# EAGLE design Silent Stepper Driver (EAGLE 7.5.0)
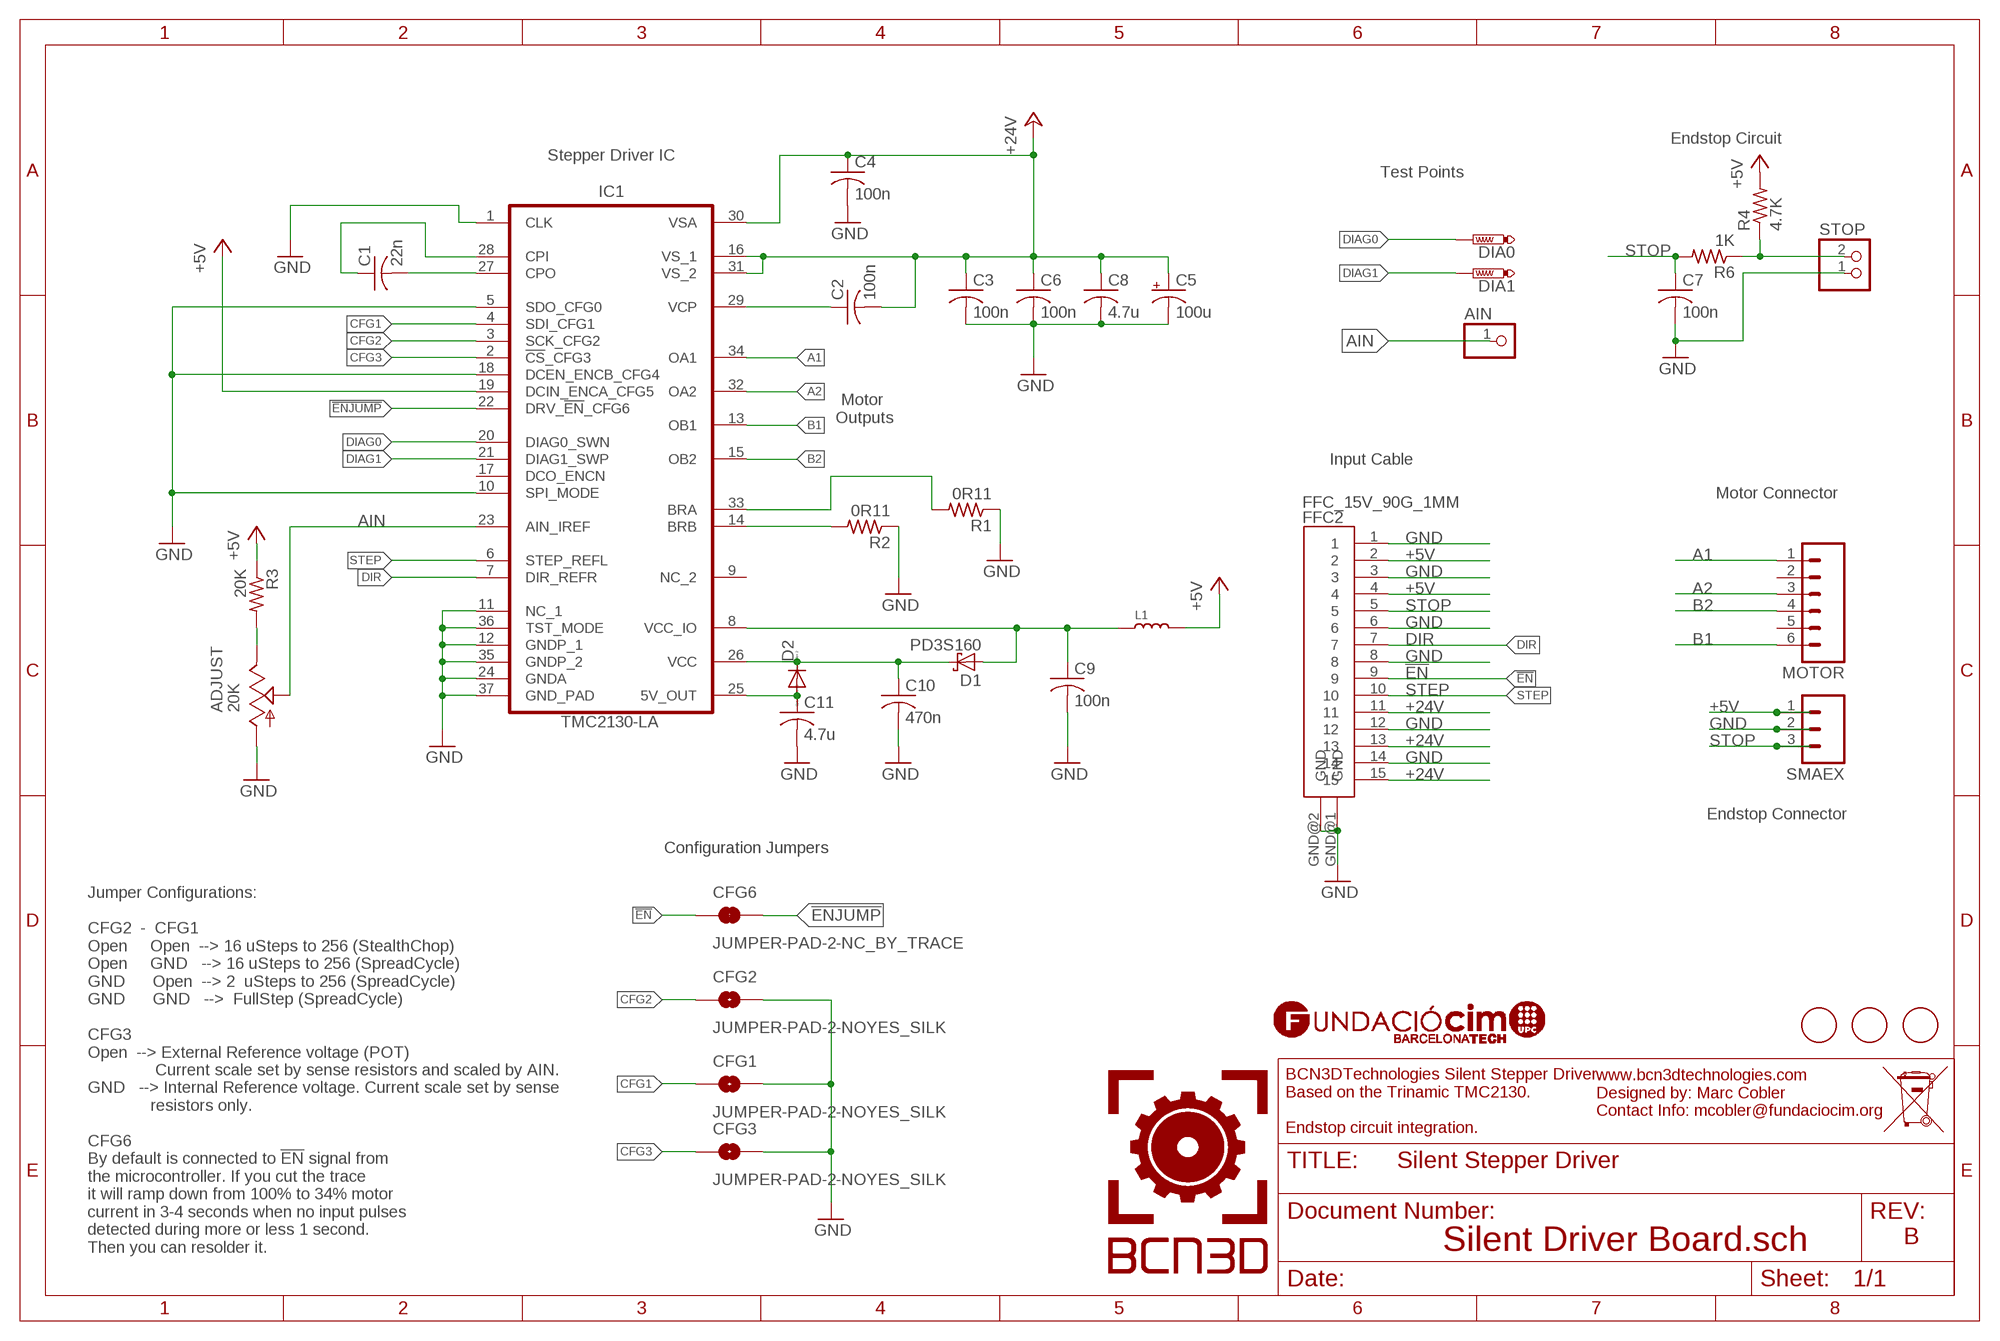
[diagram p0: schematic, sheet 1]

## Parts
ADJUST  20K  TRIM_US-3223G  [3223G]
AIN  PINHD-1X1  [1X01]
C1  22n  C-USC0603K  [C0603K]
C2  100n  C-USC0603K  [C0603K]
C3  100n  C-USC0603K  [C0603K]
C4  100n  C-USC0603K  [C0603K]
C5  100u  CPOL-USUD-6,3X7,7  [UD-6,3X7,7_NICHICON]
C6  100n  C-USC0603K  [C0603K]
C7  100n  C-USC0603K  [C0603K]
C8  4.7u  C-USC1210  [C1210]
C9  100n  C-USC0603K  [C0603K]
C10  470n  C-USC0603K  [C0603K]
C11  4.7u  C-USC0805  [C0805]
CFG1  JUMPER-PAD-2-NOYES_SILK  [PAD-JUMPER-2-NO_YES_SILK]
CFG2  JUMPER-PAD-2-NOYES_SILK  [PAD-JUMPER-2-NO_YES_SILK]
CFG3  JUMPER-PAD-2-NOYES_SILK  [PAD-JUMPER-2-NO_YES_SILK]
CFG6  JUMPER-PAD-2-NC_BY_TRACE  [PAD-JUMPER-2-NC_BY_TRACE_YES_SILK]
D1  PD3S160  [POWERDI323]
D2  DIODE-MINIMELF  [MINIMELF]
DIA0  PTR1TP12R  [TP12R]
DIA1  PTR1TP12R  [TP12R]
FFC2  FFC_15V_90G_1MM  [TE_FFC_CON1MM]
IC1  TMC2130-LA  TMC2130-LA  [TMC_QFN36_0.5_5.0X6.0]
L1  INDUCTOR/FERRITE-BEAD'0603'  [L0603]
MOTOR  M06  [JST-6-PTH]
R1  0R11  R-US_R0805  [R0805]
R2  0R11  R-US_R0805  [R0805]
R3  20K  R-US_R0603  [R0603]
R4  4.7K  R-US_R0603  [R0603]
R6  1K  R-US_R0603  [R0603]
SMAEX  M03PTH  [1X03]
STOP  JST_2PIN-THM-RA  [JST-PH-2-THM-RA]
U$2  FIDUCIAL  [FIDUCIAL_1MM]
U$3  FIDUCIAL  [FIDUCIAL_1MM]
U$4  FIDUCIAL  [FIDUCIAL_1MM]

## Nets
!EN: CFG6.1 FFC2.9
!ENJUMP: CFG6.2 IC1.22(DRV_!EN!_CFG6)
+5V [Signal]: FFC2.2 FFC2.4 IC1.19(DCIN_ENCA_CFG5) L1.2 R3.1 R4.2 SMAEX.1
+24V: C2.2 C3.1 C4.1 C5.+ C6.1 C8.1 FFC2.11 FFC2.13 FFC2.15 IC1.16(VS_1) IC1.30(VSA) IC1.31(VS_2)
A1: IC1.34(OA1) MOTOR.1
A2: IC1.32(OA2) MOTOR.3
AIN: ADJUST.2(S) AIN.1 IC1.23(AIN_IREF)
B1: IC1.13(OB1) MOTOR.6
B2: IC1.15(OB2) MOTOR.4
CFG1: CFG1.1 IC1.4(SDI_CFG1)
CFG2: CFG2.1 IC1.3(SCK_CFG2)
CFG3: CFG3.1 IC1.2(!CS!_CFG3)
DIAG0: DIA0.TP IC1.20(DIAG0_SWN)
DIAG1: DIA1.TP IC1.21(DIAG1_SWP)
DIR: FFC2.7 IC1.7(DIR_REFR)
GND: ADJUST.1(A) C3.2 C4.2 C5.- C6.2 C7.2 C8.2 C9.2 C10.2 C11.2 CFG1.2 CFG2.2 CFG3.2 FFC2.1 FFC2.3 FFC2.6 FFC2.8 FFC2.12 FFC2.14 FFC2.GND@1(GND) FFC2.GND@2(GND) IC1.1(CLK) IC1.5(SDO_CFG0) IC1.10(SPI_MODE) IC1.11(NC_1) IC1.12(GNDP_1) IC1.18(DCEN_ENCB_CFG4) IC1.24(GNDA) IC1.35(GNDP_2) IC1.36(TST_MODE) IC1.37(GND_PAD) R1.1 R2.1 SMAEX.2 STOP.1
N$1: C1.2 IC1.27(CPO)
N$2: C1.1 IC1.28(CPI)
N$3: C2.1 IC1.29(VCP)
N$4: C11.1 D2.A IC1.25(5V_OUT)
N$5: ADJUST.3(E) R3.2
N$6: C10.1 D1.C D2.C IC1.26(VCC)
N$8: IC1.33(BRA) R1.2
N$9: IC1.14(BRB) R2.2
N$10 [Signal]: C9.1 D1.A IC1.8(VCC_IO) L1.1
N$25: R4.1 R6.1 STOP.2
STEP: FFC2.10 IC1.6(STEP_REFL)
STOP: C7.1 FFC2.5 R6.2 SMAEX.3
Unconnected: IC1.9(NC_2) IC1.17(DCO_ENCN) MOTOR.2 MOTOR.5

## Notes on the sheet
- Endstop Circuit
- Stepper Driver IC
- Test Points
- Motor 
  Outputs
- Input Cable
- Motor Connector
- Endstop Connector
- Configuration Jumpers
- www.bcn3dtechnologies.com
  Designed by: Marc Cobler
  Contact Info: mcobler@fundaciocim.org
- BCN3DTechnologies Silent Stepper Driver. 
  Based on the Trinamic TMC2130.
  
  Endstop circuit integration.
- B
- Silent Driver Board.sch
- Jumper Configurations:
  
  CFG2  -  CFG1
  Open     Open  --> 16 uSteps to 256 (StealthChop)
  Open     GND   --> 16 uSteps to 256 (SpreadCycle)
  GND      Open  --> 2  uSteps to 256 (SpreadCycle)
  GND      GND   -->  FullStep (SpreadCycle)
  
  CFG3
  Open  --> External Reference voltage (POT) 
                 Current scale set by sense resistors and scaled by AIN. 
  GND   --> Internal Reference voltage. Current scale set by sense 
                resistors only.
  
  CFG6
  By default is connected to !EN! signal from 
  the microcontroller. If you cut the trace 
  it will ramp down from 100% to 34% motor
  current in 3-4 seconds when no input pulses
  detected during more or less 1 second.
  Then you can resolder it.

## Library data of the parts
ADJUST = pot:TRIM_US-: POTENTIOMETER; MF: BOURNS; MPN: 3314G-2-203E; OC_FARNELL: 2328481
AIN = pinhead:PINHD-1X1: PIN HEADER
C1 = rcl:C-US: CAPACITOR, American symbol; MF: MURATA; MPN: GCM188R72A223KA37D; OC_FARNELL: 2494195
C2-C4 C6 C7 C9 = rcl:C-US: CAPACITOR, American symbol; MF: AVX; MPN: 06035C104KAT2A; OC_FARNELL: 1301804
C5 = rcl:CPOL-US: POLARIZED CAPACITOR, American symbol; MF: PANASONIC ELECTRONIC COMPONENTS; MPN: EEE1HA101UAP; OC_FARNELL: 2326148
C8 = rcl:C-US: CAPACITOR, American symbol; MF: KEMET; MPN: C1210X475K5RACTU; OC_FARNELL: 1414067
C10 = rcl:C-US: CAPACITOR, American symbol; MF: MURATA; MPN: GRM188R71C474KA88D; OC_FARNELL: 1828893
C11 = rcl:C-US: CAPACITOR, American symbol; MF: AVX; MPN: 0805YC475KAT2A; OC_FARNELL: 1657937
CFG1-CFG3 = SparkFun-Passives:JUMPER-PAD-2-NO
CFG6 = SparkFun-Passives:JUMPER-PAD-2-NC_BY_TRACE
D1 = diode:PD3S160: 1.0A SURFACE MOUNT SCHOTTKY BARRIER RECTIFIER POWERDI ® 323 Source: http://www.diodes.com/datasheets/ds30899.pdf; MF: DIODES INC.; MPN: PD3S160-7; OC_FARNELL: 1843697
D2 = diode:DIODE-: DIODE; MF: NXP; MPN: PMLL4448; OC_FARNELL: 1097279
DIA0 DIA1 = testpad:PTR1: TEST PIN; OC_FARNELL: unknown
FFC2 = MarcEagleParts:FFC_15V_90G_1MM; OC_FARNELL: unknown
IC1 = TMC2130-LA:TMC2130-LA: Universal high voltage driver for two-phase bipolar stepper motor, SPI, Step/Dir, QFN36(5x6); DATASHEET: http://www_trinamic_com/_scripts/download_php?file=_articles%2Fproducts%2Fintegrated-circuits%2Ftmc2130%2F_datasheet%2FTMC2130_datasheet_pdf; DESCRIPTION: Universal high voltage driver for two-phase bipolar stepper motor, SPI, Step/Dir, QFN36(5x6); DISTRIBUTOR1: Digikey; GEOMETRY_HEIGHT: 0_8mm; MANUFACTURER: TRINAMIC; OC_FARNELL: unknown; ORDERCODE-DISTRI1: 1460-1130-1-ND; ORDERCODE-MANU1: TMC2130-LA
L1 = Seeed-OPL-Inductor:INDUCTOR/FERRITE-BEAD
MOTOR = MarcEagleParts:M06: Header 6 Standard 6-pin 0.1" header. Use with straight break away headers (SKU : PRT-00116), right angle break away headers (PRT-00553), swiss pins (PRT-00743), machine pins (PRT-00117), and female headers (PRT-00115). Molex polarized connector foot print use with SKU : PRT-08094 with associated crimp pins and housings. NOTES ON THE VARIANTS LOCK and LOCK_LONGPADS... This footprint was designed to help hold the alignment of a through-hole component (i.e. 6-pin header) while soldering it into place. You may notice that each hole has been shifted either up or down by 0.005 of an inch from it's more standard position (which is a perfectly straight line). This slight alteration caused the pins (the squares in the middle) to touch the edges of the holes. Because they are alternating, it causes a "brace" to hold the component in place. 0.005 has proven to be the perfect amount of "off-center" position when using our standard breakaway headers. Although looks a little odd when you look at the bare footprint, once you have a header in there, the alteration is very hard to notice. Also,if you push a header all the way into place, it is covered up entirely on the bottom side. This idea of altering the position of holes to aid alignment will be further integrated into the Sparkfun Library for other footprints. It can help hold any component with 3 or more connection pins.; MF: JST (JAPAN SOLDERLESS TERMINALS); MPN: S6B-PH-K-S (LF)(SN); OC_FARNELL: 9492500
R1 R2 = rcl:R-US_: RESISTOR, American symbol; MF: PANASONIC ELECTRONIC COMPONENTS; MPN: ERJ6BSFR11V; OC_FARNELL: 2493027
R3 = rcl:R-US_: RESISTOR, American symbol; MF: MULTICOMP; MPN: MC0201L6F2002SE.; OC_FARNELL: 1837767
R4 = rcl:R-US_: RESISTOR, American symbol; MF: PANASONIC ELECTRONIC COMPONENTS; MPN: ERJP06F4701V; OC_FARNELL: 1750763
R6 = rcl:R-US_: RESISTOR, American symbol; MF: BOURNS; MPN: CR0805-JW-102ELF; OC_FARNELL: 2008389
SMAEX = SparkFun-Connectors:M03: Header 3 Standard 3-pin 0.1" header. Use with straight break away headers (SKU : PRT-00116), right angle break away headers (PRT-00553), swiss pins (PRT-00743), machine pins (PRT-00117), and female headers (PRT-00115). Molex polarized connector foot print use with SKU : PRT-08232 with associated crimp pins and housings.; OC_FARNELL: unknown
STOP = adafruit:JST_2PIN: JST 2-Pin Connectors of various flavors SMT-RA (S2B-PH-SM4) 4UConnector #17311 SMT (B2B-PH-SM4) THM-RA (S2B-PH) THM (B2B-PH); MF: JST (JAPAN SOLDERLESS TERMINALS); MPN: S2B-PH-K-S (LF)(SN); OC_FARNELL: 9491902
U$2-U$4 = adafruit:FIDUCIAL: For use by pick and place machines to calibrate the vision/machine, 1mm By microbuilder.eu; OC_FARNELL: unknown

## Net classes
0 Mini Power: width 0.254 mm, drill 0.254 mm, clearance 0.254 mm
1 Medium Power: width 0.305 mm, drill 0.254 mm, clearance 0.305 mm
2 High Power: width 2.54 mm, drill 0.508 mm, clearance 0.508 mm
3 Signal: width 0.229 mm, drill 0.229 mm, clearance 0.229 mm

## Board
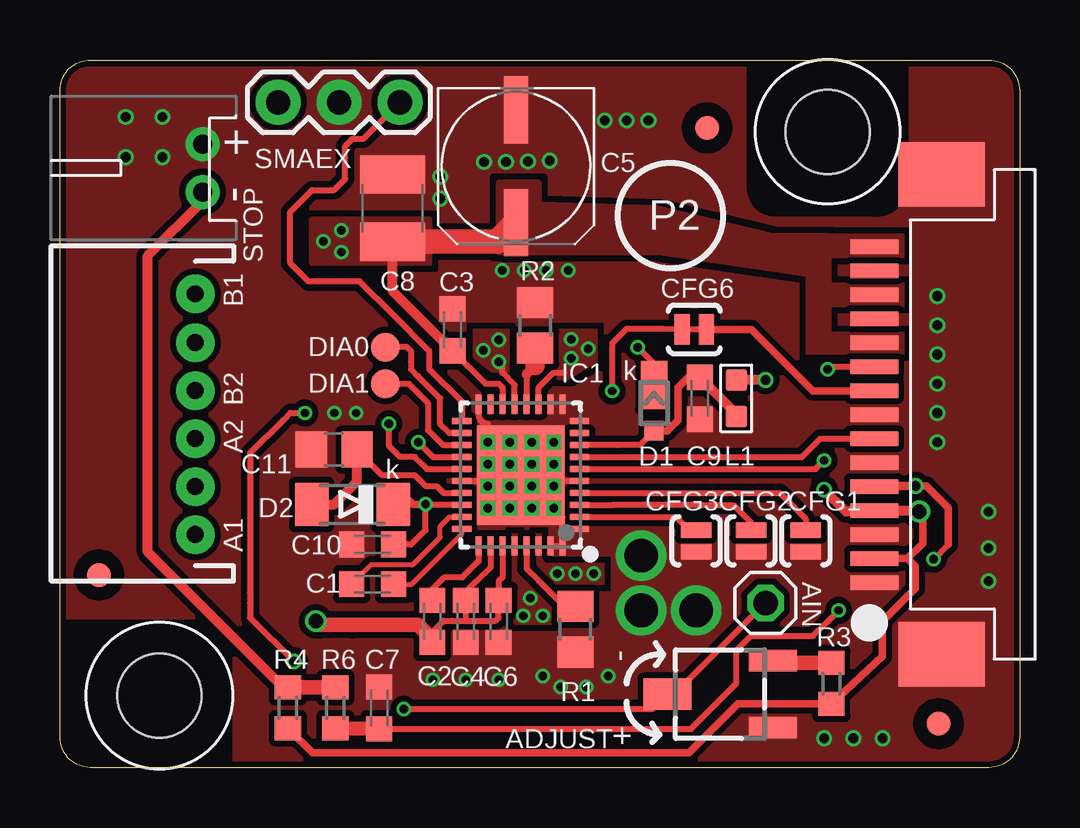
[diagram p1: board, top side]
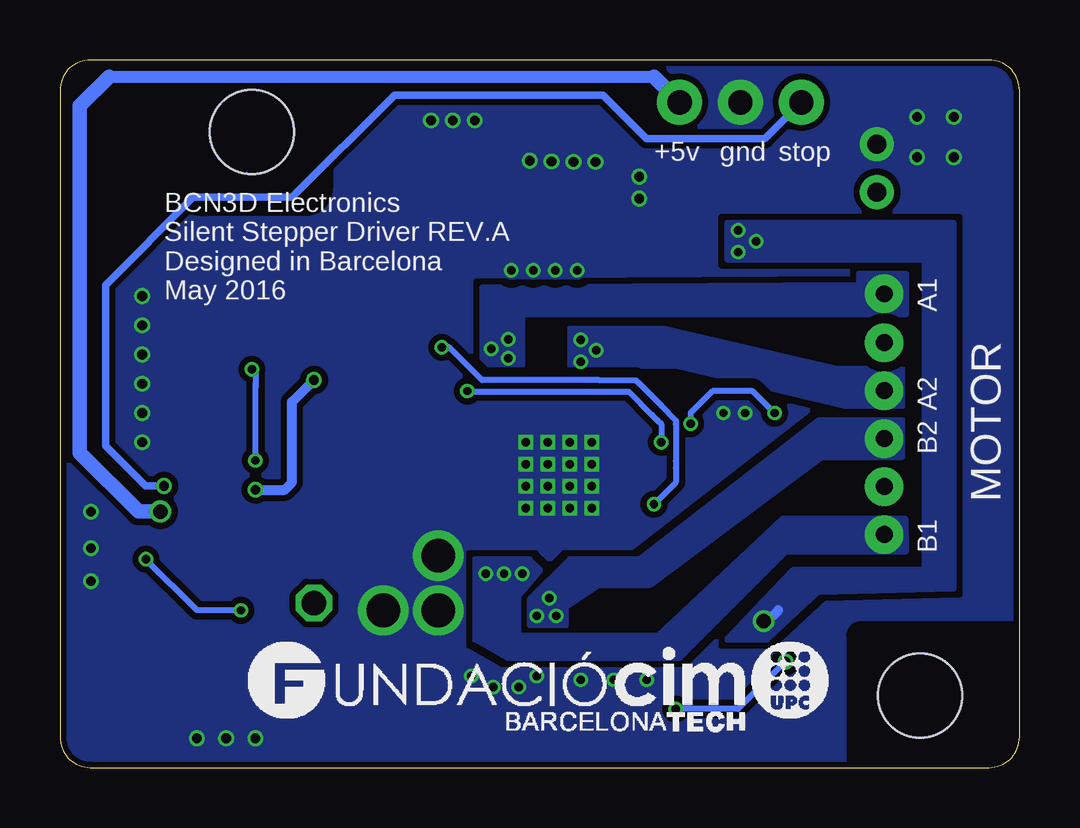
[diagram p2: board, bottom side, seen from below]

Size 40 x 29.5 mm. Coordinates in mm from the lower left corner, seen from the top.
Outline: 38.73,0 1.27,0 arc-90 0,1.27 0,28.23 arc-90 1.27,29.5 38.73,29.5 arc-90 40,28.23 40,1.27 arc-90 38.73,0
Copper layers (1*16): Top 0.018mm / dielectric 1.55mm / Bottom 0.018mm
Design rules "eC_2Layer_PClass6_BaseCopperO18_eCDefault *": minimum track width 0.15mm, minimum drill 0.35mm, track to track 0.15mm, track to pad 0.15mm, pad to pad 0.15mm, via to via 0.15mm, smd to smd 0mil, copper to edge 0.25mm, drill to drill 0.35mm, minimum pad ring 0.175mm, minimum via ring 0.125mm, stop-mask expansion 0mil, vias tented up to drill 0.45mm, thermal gap 0.2mm
Holes 3.5 mm at 32,26.5 4.15,3

### Footprints (pad centres in the part's own frame; a part is rotated, then mirrored left to right if it is on the bottom)
3223G = smd 2 x 0.9: 1 -2.2,1.4; 3 -2.2,-1.4 | smd 2 x 1.3: 2 2.2,0
1X01 = drill 1.016 octagon: 1 0,0
C0603K = smd 1.05 x 1.08: 1 -0.875,0; 2 0.875,0
UD-6,3X7,7_NICHICON = smd 2.8 x 1: + 2.35,0; - -2.35,0
C1210 = smd 1.6 x 2.7: 1 -1.4,0; 2 1.4,0
C0805 = smd 1.3 x 1.5: 1 -0.95,0; 2 0.95,0
PAD-JUMPER-2-NO_YES_SILK = smd 0.635 x 1.27: 1 -0.45,0; 2 0.45,0
PAD-JUMPER-2-NC_BY_TRACE_YES_SILK = smd 0.635 x 1.27: 1 -0.508,0; 2 0.508,0
POWERDI323 = smd 0.8 x 0.8: A 1.15,0 | smd 2 x 1.1: C -0.75,0
MINIMELF = smd 1.4 x 1.8: A 1.7,0; C -1.7,0
TP12R = smd 1.2 x 1.2: TP 0,0
TE_FFC_CON1MM = smd 0.61 x 2: 1 -7.01,2.8; 2 -6.01,2.8; 3 -5.01,2.8; 4 -4.01,2.8; 5 -3.01,2.8; 6 -2.01,2.8; 7 -1.01,2.8; 8 -0.01,2.8; 9 0.99,2.8; 10 1.99,2.8; 11 2.99,2.8; 12 3.99,2.8; 13 4.99,2.8; 14 5.99,2.8; 15 6.99,2.8 | smd 2.68 x 3.6: GND@1 -10,0; GND@2 10,0
TMC_QFN36_0.5_5.0X6.0 = smd 0.25 x 0.8: 1 -2.25,-2.45; 2 -1.75,-2.45; 3 -1.25,-2.45; 4 -0.75,-2.45; 5 -0.25,-2.45; 6 0.25,-2.45; 7 0.75,-2.45; 8 1.25,-2.45; 9 1.75,-2.45; 10 2.25,-2.45; 19 2.25,2.45; 20 1.75,2.45; 21 1.25,2.45; 22 0.75,2.45; 23 0.25,2.45; 24 -0.25,2.45; 25 -0.75,2.45; 26 -1.25,2.45; 27 -1.75,2.45; 28 -2.25,2.45 | smd 0.8 x 0.25: 11 2.95,-1.75; 12 2.95,-1.25; 13 2.95,-0.75; 14 2.95,-0.25; 15 2.95,0.25; 16 2.95,0.75; 17 2.95,1.25; 18 2.95,1.75; 29 -2.95,1.75; 30 -2.95,1.25; 31 -2.95,0.75; 32 -2.95,0.25; 33 -2.95,-0.25; 34 -2.95,-0.75; 35 -2.95,-1.25; 36 -2.95,-1.75 | smd 4.15 x 3.65: 37 0,0
L0603 = smd 0.889 x 0.889: 1 -0.762,0; 2 0.762,0
JST-6-PTH = drill 0.7 pad 1.6: 1 -4,0; 2 -2,0; 3 0,0; 4 2,0; 5 4,0; 6 6.032,0
R0805 = smd 1.3 x 1.5: 1 -0.95,0; 2 0.95,0
R0603 = smd 1 x 1.1: 1 -0.85,0; 2 0.85,0
1X03 = drill 1.016 pad 1.88: 1 0,0; 2 2.54,0; 3 5.08,0
JST-PH-2-THM-RA = drill 0.8 pad 1.422: 1 1,0; 2 -1,0
FIDUCIAL_1MM = smd 1 x 1: 1 0,0

### Placement (x,y rotation side)
ADJUST  27.52,3.06 180 top
AIN  29.41,6.86 0 top
C1  13.03,7.65 180 top
C2  15.52,6.1 270 top
C3  16.36,18.25 90 top
C4  16.92,6.1 270 top
C5  19.01,25.06 270 top
C6  18.29,6.1 270 top
C7  13.31,2.49 90 top
C8  13.87,23.32 90 top
C9  26.67,15.39 270 top
C10  13.03,9.3 180 top
C11  11.43,13.26 180 top
CFG1  31.09,9.45 270 top
CFG2  28.8,9.45 270 top
CFG3  26.52,9.45 270 top
CFG6  26.44,18.26 180 top
D1  24.77,15.19 270 top
D2  12.19,10.97 180 top
DIA0  13.56,17.53 0 top
DIA1  13.56,16 0 top
FFC2  36.75,14.72 90 top
IC1  19.2,12.19 90 top
L1  28.19,15.39 90 top
MOTOR  5.64,13.72 90 top
R1  21.49,5.77 90 top
R2  19.81,18.44 270 top
R3  32.16,3.51 90 top
R4  9.5,2.49 270 top
R6  11.48,2.49 270 top
SMAEX  14.17,27.74 180 top
STOP  5.94,24.99 90 top
U$2  36.63,1.83 0 top
U$3  1.63,8.03 0 top
U$4  26.97,26.67 0 top
U$5  [FCIM_LOGO]  33.99,-2.13 0 bottom

### Tracks (layer width: path | path; a pad name or v marks a point on that pad's centre or on a via)
!EN
  Top 0.254: FFC2.9 33.09,15.71
  Top 0.305: 33.09,15.71 33.07,15.7 31.39,15.7 28.83,18.26 CFG6.1
  Top 0.356: 33.93,15.7 FFC2.9 33.96,15.7
!ENJUMP  (via drill 0.35)
  Top 0.254: CFG6.2 25.15,18.29 23.62,18.29 23.01,17.68 v23.01,15.7 | v14.94,13.56 15.56,12.94 IC1.22
  Bottom 0.254: v23.01,15.7 22.99,15.67 16.28,15.67 15.32,14.71 15.09,14.48 14.94,14.33 v14.94,13.56
+5V  (via drill 0.41, 0.61)
  Top 0.254: IC1.19 16.75,15.25 15.39,16.61 15.39,17.37 13.87,18.9 12.5,20.27 10.36,20.27 9.6,21.03 9.6,23.16 10.52,24.08 11.43,24.08 11.89,24.54 11.89,25.91 12.19,26.21 12.65,26.21 SMAEX.1
  Top 0.305: FFC2.2 35.33,8.71 | 35.33,8.71 35.66,8.38 35.66,7.47 34.29,6.1 34.29,4.64 R3.1 28.26,2.65 26.52,0.91 26.21,0.61 11.89,0.61 11.43,0.61 10.53,0.61 R4.2 | FFC2.2 33.92,8.69 FFC2.2 | 33.25,8.71 FFC2.2 | 35.33,8.71 35.97,9.35 35.97,10.52 v35.81,10.67 | 33.9,10.67 FFC2.4
  Top 0.356: 9.45,1.34 R4.2
  Top 0.406: FFC2.4 35.77,10.71 v35.81,10.67 | 33.9,10.67 32.77,10.67 v31.85,11.58 | v29.41,16.15 L1.2
  Bottom 0.406: v31.85,11.58 30.63,11.58 30.33,11.89 30.33,15.24 v29.41,16.15
  Bottom 0.508: 37.95,28.8 15.24,28.8
  Bottom 0.61: SMAEX.1 15.24,28.8 | 37.95,28.8 39.17,27.58 39.17,13.11 36.73,10.67 35.97,10.67 v35.81,10.67
+24V  (via drill 0.35, 0.6)
  Top 0.254: IC1.30 17.95,8.66 17.95,8.35 17.37,7.77 16.92,7.32 C4.1 | 17.07,7.12 C4.1 | IC1.31 18.45,7.94 18.29,7.77 C6.1 18.29,6.25 18.16,6.12 16.92,6.12 | 16.92,6.62 C4.1 | 15.52,5.36 C2.2 15.52,5.36 | 15.52,5.36 15.52,5.64 15.93,6.04 16,6.12 16.36,6.12 16.64,6.12 16.92,6.12 | C3.1 17.73,16 17.98,16 18.29,16 18.44,15.85 18.45,15.84 IC1.16 | C4.1 16.92,6.12
  Top 0.305: 18.33,6.97 C6.1 | 16.92,6.71 C4.1
  Top 0.406: C3.1 13.87,19.87 C8.1 | 10.82,5.94 v10.67,6.1
  Top 0.61: 15.52,5.36 14.94,5.94 12.19,5.94 10.82,5.94
  Top 1.016: C5.+ 18.21,21.92 C8.1
  Bottom 0.406: v10.67,6.1 10.52,6.1 10.06,6.55
  other vias: 10.97,21.95 11.73,22.4 11.73,21.49
  pour Top (no thermals): 35.2,22.25 31.09,22.25 31.09,17.22 35.2,17.22 35.2,18.16 32.16,18.16 32.16,19.2 35.2,19.2 35.2,20.22 32.16,20.22 32.16,21.23 35.2,21.23
  pour Top (no thermals): 18.29,24.38 18.29,21.49 24.99,21.49 31.24,20.57 31.24,17.98 32,17.98 32,22.15 29.67,22.15 24.84,23.32 19.96,23.47 19.96,24.38
  pour Top (no thermals): 10.52,22.86 15.39,22.86 15.39,21.03 10.52,21.03
  pour Bottom (no thermals): 12.19,22.71 12.19,21.18 3.96,21.18 3.96,8.23 9.45,8.23 12.19,5.33 10.52,5.33 8.38,7.32 2.74,7.47 2.74,22.71
A1  (via drill 0.35)
  other vias: 20.73,8.08 21.49,8.08 22.25,8.08
  pour Top (no thermals): 19.81,9.75 19.81,8.38 20.57,7.62 22.71,7.62 22.71,8.53 20.27,8.53 20.12,8.69 20.12,9.75
  pour Bottom (isolate 0.254, no thermals): 4.72,9.02 4.75,10.36 9.91,10.36 15.09,5.49 20.88,5.49 20.88,7.16 19.96,8.23 20.42,8.69 22.71,8.69 22.71,5.33 21.34,4.57 14.17,4.57 9.75,8.99
A2  (via drill 0.35)
  other vias: 19.61,7.06 20.12,6.32 19.3,6.32
  pour Top (no thermals): 18.75,9.75 19.2,9.75 19.2,8.08 19.51,8.08 20.57,7.16 20.57,5.94 18.9,5.94 18.9,7.62 18.75,7.77
  pour Bottom (isolate 0.254, no thermals): 18.75,8.69 20.42,7.01 20.42,5.94 18.9,5.94 18.9,6.71 17.53,7.62 15.39,7.62 8.23,12.95 4.88,12.95 4.88,14.48 8.38,14.48 15.85,8.69
AIN  (via drill 0.35, 0.41)
  Top 0.254: IC1.23 15.29,12.44 15.09,12.65 14.78,12.95 14.17,12.95 13.72,13.41 v13.72,14.33 | v10.21,14.78 9.6,14.78 9.3,14.48 7.92,13.11 7.92,7.32 7.92,6.86 7.92,6.25 v9.75,4.42 | 25.3,2.74 ADJUST.2 | v14.33,2.44 24.69,2.44 ADJUST.2 | AIN.1 25.62,3.06 ADJUST.2
  Bottom 0.254: v13.72,14.33 13.72,14.78 12.8,15.7 11.12,15.7 v10.21,14.78 | v9.75,4.42 11.73,2.44 v14.33,2.44
B1  (via drill 0.35)
  Top 0.254: IC1.13 19.95,15.84 20.57,16.46 21.03,16.46
  other vias: 21.31,17.07 21.31,17.86 22.02,17.45
  pour Top (no thermals): 22.4,18.29 22.4,16.92 21.18,16.15 20.73,16.15 20.73,18.29
  pour Bottom (isolate 0.406, no thermals): 22.4,16.76 20.73,16.76 20.73,18.9 4.72,18.9 4.72,20.57 6.71,20.57 6.71,20.12 22.4,20.02
B2  (via drill 0.35)
  Top 0.254: IC1.15 18.95,15.95 18.44,16.46 18.44,16.76 v18.29,16.92
  other vias: 18.29,17.83 17.65,17.4
  pour Top (no thermals): 17.22,18.29 18.75,18.29 18.75,16.46 17.98,16.46 17.22,17.07
  pour Bottom (isolate 0.406, no thermals): 14.33,16.76 7.32,15.09 4.88,15.09 4.88,16.61 7.62,16.61 14.78,18.29 18.75,18.29 18.75,16.76
CFG1
  Top 0.254: IC1.4 23.3,11.44 27.88,11.44 30.01,11.44 31.09,10.36 CFG1.1
CFG2
  Top 0.254: IC1.3 23.04,10.94 26.69,10.94 27.31,10.94 28.07,10.94 28.8,10.21 CFG2.1
CFG3
  Top 0.254: IC1.2 22.32,10.44 25.07,10.44 25.67,10.44 26.21,9.9 CFG3.1
DIAG0
  Top 0.254: IC1.20 16.23,13.94 15.85,14.33 15.85,15.39 14.94,16.31 14.63,16.61 14.63,16.92 14.63,17.37 14.48,17.53 DIA0.TP
DIAG1
  Top 0.254: DIA1.TP 14.53,16 15.34,15.19 15.34,14.07 15.85,13.56 15.97,13.44 IC1.21
DIR
  Top 0.254: FFC2.7 31.7,13.71 31.55,13.56 30.93,12.94 23.33,12.94 IC1.7
GND  (via drill 0.35, 0.36, 0.41, 1.4 pad 1.42)
  Top 0.254: IC1.35 IC1.36 20.95,10.44 v20.57,10.82 | IC1.24 17.62,11.94 v17.83,11.73 | IC1.5 20.78,11.94 v20.57,11.73 | IC1.18 17.45,14.7 arc90 17.83,14.33
  other vias: 4.27,25.45 2.74,27.13 4.27,27.13 2.74,25.45 36.58,18.44 19.51,25.27 18.59,25.25 20.42,25.3 17.83,13.56 18.75,13.56 19.66,13.56 20.57,13.56 17.83,12.65 18.75,12.65 19.66,12.65 20.57,12.65 18.75,11.73 19.66,11.73 17.83,10.82 18.75,10.82 19.66,10.82 36.58,17.22 36.58,16 36.58,14.78 36.58,13.56 21.95,3.35 22.86,3.81 16.92,3.66 38.71,10.67 38.71,9.14 38.71,7.77 20.88,3.35 20.12,3.81 18.29,3.66 15.54,3.66 18.44,20.73 19.35,20.73 20.27,20.73 21.18,20.73 17.68,25.25 15.85,23.72 15.85,24.64 24.23,8.84 24.23,6.55 26.52,6.55 11.43,14.78 12.34,14.78 36.58,19.66 31.85,1.22 33.07,1.22 34.29,1.22 22.71,26.97 23.62,26.97 24.54,26.97
  pour Top (rank 6, no thermals): 0,29.72 28.5,29.72 28.5,24.13 arc90 29.77,22.86 33.78,22.86 arc90 35.51,24.13 35.51,29.72 40.13,29.72 40.13,-0.25 7.32,-0.15 7.32,5.6 arc91 6.63,6.26 0,6.29
  pour Bottom (rank 6, no thermals): 0,29.72 28.5,29.72 28.5,24.13 arc90 29.77,22.86 33.78,22.86 arc90 35.51,24.13 35.51,29.72 40.08,29.72 40.08,-0.15 7.32,-0.15 7.32,5.26 arc91 6.78,6.22 0,6.25
N$1
  Top 0.203: C1.2 12.89,8.38 12.98,8.46 14.66,8.46 14.71,8.46 15.85,9.6 15.85,10.06 16.15,10.36 16.23,10.44 IC1.27
N$2
  Top 0.203: C1.1 14.66,7.64 15.7,8.69 16.75,9.74 IC1.28
N$3
  Top 0.254: IC1.29 17.45,8.61 16.76,7.92 16,7.92 15.54,7.47 15.54,7 C2.1
N$4
  Top 0.254: C11.1 12.38,13.22 13.41,12.19 14.78,12.19 15.24,11.73 15.7,11.73 15.99,11.44 IC1.25
  Top 0.406: D2.A 11.43,10.97 12.19,11.73 12.38,11.92 C11.1
N$5
  Top 0.61: R3.2 29.82,4.36 ADJUST.3
N$6  (via drill 0.35)
  Top 0.254: C10.1 14.63,9.3 15.09,9.75 15.24,9.91 v15.24,10.97 arc90 15.27,10.94 IC1.26 | D2.C 14.07,10.94 14.41,11.28 | v24.08,17.53 24.77,16.84 D1.C
  Top 0.305: 14.41,11.28 14.72,10.97 v15.24,10.97
  Bottom 0.254: v24.08,17.53 23.77,17.53 22.4,16.15 17.53,16.15 16.15,16.15 16,16.15 15.85,16 14.94,15.09 14.33,14.48 14.33,14.33 14.33,12.8 14.33,12.5 14.33,11.89 v15.24,10.97
N$8
  Top 0.254: 20.88,6.71 21.48,6.71 R1.2 21.02,6.72 19.96,7.77 19.45,8.28 IC1.33
N$9
  Top 0.254: R2.2 19.91,17.28 | 19.45,16.4 IC1.14
  Top 0.406: 19.45,16.4 19.81,16.76
  Top 0.813: 19.81,16.76 R2.2
N$10
  Top 0.254: IC1.8 23.25,13.44 24.17,13.44 D1.A
  Top 0.305: C9.1 26.17,16.27 25.76,15.85 25.76,14.48 25.45,14.17 25.32,14.04 D1.A
  Top 0.406: L1.1 28.19,14.74 C9.1
N$25
  Top 0.406: 10.06,3.34 9.31,3.34 7.62,5.03 5.79,6.86 3.66,8.99 3.66,21.34 5.94,23.62 STOP.2
  Top 0.61: R4.1 10.06,3.34 R6.1
STEP  (via drill 0.35)
  Top 0.254: IC1.6 23.07,12.44 31.49,12.44 v31.85,12.8 | v32,16.61 32.11,16.71 FFC2.10
  Bottom 0.254: v31.85,12.8 31.85,15.85 | 31.85,15.85 31.85,16 | v32,16.61 31.85,16.46 31.85,15.85
STOP  (via drill 0.35, 0.41)
  Top 0.254: C7.1 25.24,1.61 26.3,1.61 26.98,2.29 28.19,3.5 28.19,4.88 28.8,5.49 29.41,5.49 31.39,5.49 | 31.39,5.49 31.93,6.02 | 31.93,6.02 v32.46,6.55 | v36.42,8.69 37.03,9.3 | 31.39,5.49 31.93,6.02
  Top 0.305: v35.66,11.73 36.12,11.73 37.03,10.82 37.03,9.3
  Top 0.356: v35.66,11.73 33.97,11.73 FFC2.5
  Top 0.61: R6.2 C7.1
  Bottom 0.254: v32.46,6.55 34.29,6.55 v36.42,8.69
  Bottom 0.305: SMAEX.3 10.62,26.21 15.54,26.21 17.37,28.04 26.06,28.04 30.33,23.77 34.44,23.77 38.1,20.12 38.1,13.41 36.42,11.73 v35.66,11.73

### Text on the board
tPlace: P2 | B1 | k | B2 | A2 | k | A1 | - | +
bPlace: stop | gnd | +5v | A1 | BCN3D Electronics / Silent Stepper Driver REV.A / Designed in Barcelona / May 2016 | A2 | B2 | B1
DrillLegend_01-16: 01-16
DrillLegend_01-20: 01-20